# Altium schematic sheet io.SchDoc
size A
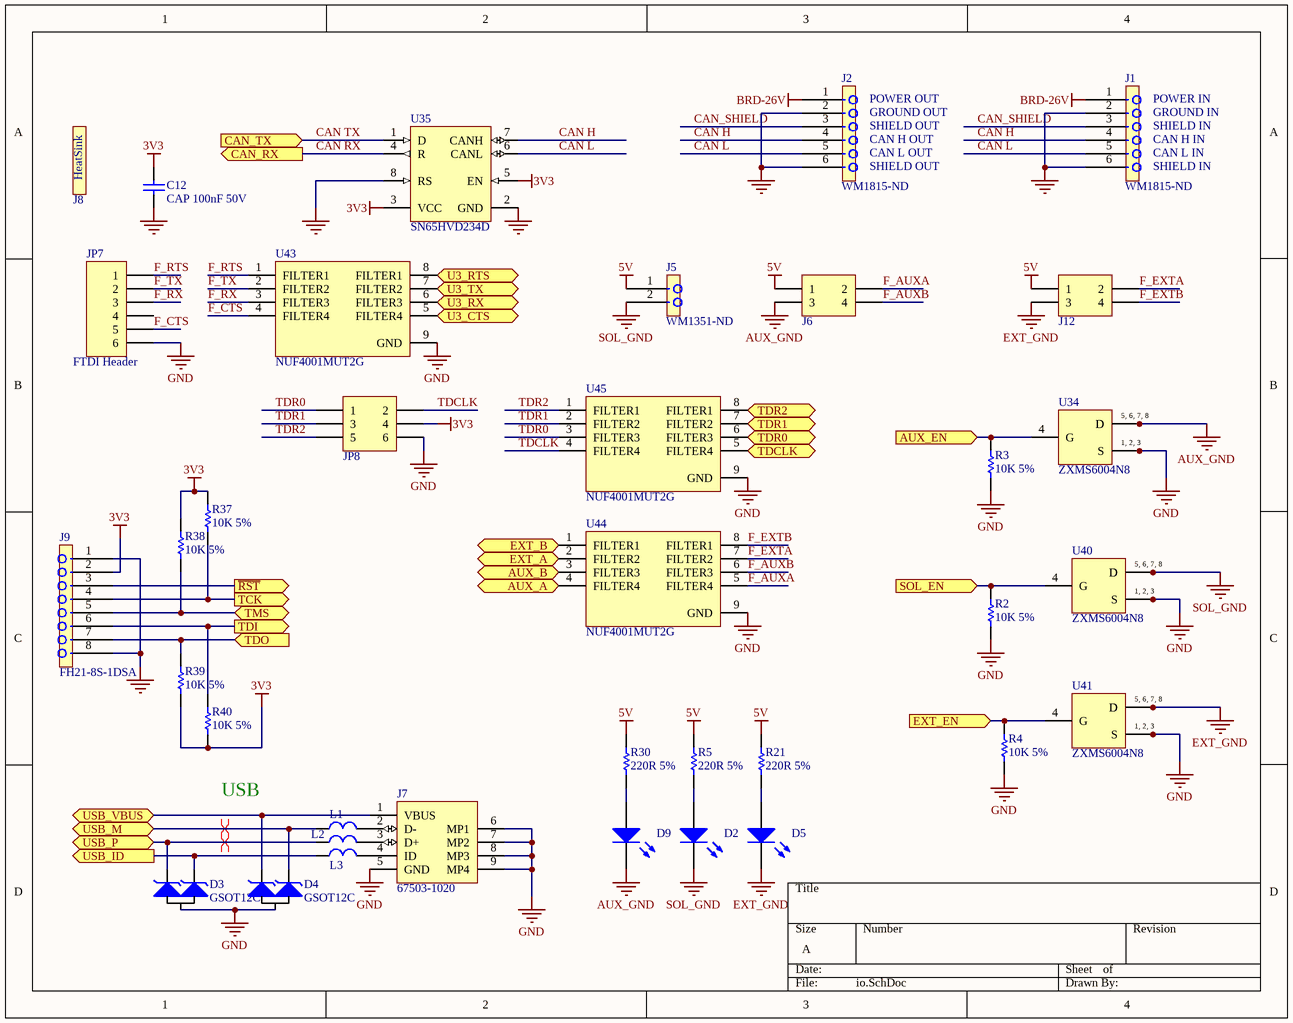
[diagram p0: io.SchDoc]

## Parts
C12  CAP 100nF 50V  [CAPC0603(1608)100_M]
D2  LED  [LED-0603]  (value not drawn)
D3  GSOT12C  [SOT-23 - ESD]
D4  GSOT12C  [SOT-23 - ESD]
D5  LED  [LED-0603]  (value not drawn)
D9  LED  [LED-0603]  (value not drawn)
J1  WM1815-ND  [M43045H-6]
J2  WM1815-ND  [M43045H-6]
J5  WM1351-ND  [M5569-2]
J6  Header 2x2 2.54mm  [Molex 39-30-1040]  (value not drawn)
J7  67503-1020  [MOLX-67503-1020_V]
J8  HeatSink  [HeatSink]  (value not drawn)
J9  FH21-8S-1DSA  [FH21-8S-1DSA]
J12  Header 2x2 2.54mm  [Molex 39-30-1040]  (value not drawn)
JP7  FTDI Header  [1X6]
JP8  Header 3x2 2.54mm  [2X3]  (value not drawn)
L1  MPZ1608S102A  [0603]  (value not drawn)
L2  MPZ1608S102A  [0603]  (value not drawn)
L3  MPZ1608S102A  [0603]  (value not drawn)
R2  10K 5%  [RESC0603(1608)_N]
R3  10K 5%  [RESC0603(1608)_N]
R4  10K 5%  [RESC0603(1608)_N]
R5  220R 5%  [RESC0603(1608)_M]
R21  220R 5%  [RESC0603(1608)_M]
R30  220R 5%  [RESC0603(1608)_M]
R37  10K 5%  [RESC0603(1608)_N]
R38  10K 5%  [RESC0603(1608)_N]
R39  10K 5%  [RESC0603(1608)_N]
R40  10K 5%  [RESC0603(1608)_N]
U34  ZXMS6004N8  [SO-8]
U35  SN65HVD234D  [D8_M]
U40  ZXMS6004N8  [SO-8]
U41  ZXMS6004N8  [SO-8]
U43  NUF4001MUT2G  [ONSC-UDFN-8-517AD_V]
U44  NUF4001MUT2G  [ONSC-UDFN-8-517AD_V]
U45  NUF4001MUT2G  [ONSC-UDFN-8-517AD_V]

## Ports
AUX_A (bidir), AUX_B (bidir), AUX_EN (in), CAN_RX (out), CAN_TX (in), EXT_A (bidir), EXT_B (bidir), EXT_EN (in), SOL_EN (in), TCK (out), TDCLK (bidir), TDI (out), TDO (in), TDR0 (bidir), TDR1 (bidir), TDR2 (bidir), TMS (bidir), U3_CTS (in), U3_RTS (out), U3_RX (out), U3_TX (in), USB_ID (out), USB_M (bidir), USB_P (bidir), USB_VBUS, ~{RST} (out)

## Nets
3V3: C12.2 J9.2 JP8.4 R37.2 R38.2 R39.1 R40.1 U35.3(VCC) U35.5(EN)
5V: J5.1 J6.1 J12.1 R5.2 R21.2 R30.2
AUX_GND: D9.2(K) J6.3 U34.5(D) U34.6(D) U34.7(D) U34.8(D)
BRD-26V: J1.1 J2.1
EXT_GND: D5.2(K) J12.3 U41.5(D) U41.6(D) U41.7(D) U41.8(D)
GND: C12.1 D3.3(A) D4.3(A) J1.2 J1.6 J2.2 J2.6 J7.5(GND) J7.6(MP1) J7.7(MP2) J7.8(MP3) J7.9(MP4) J9.1 J9.8 JP7.6 JP8.6 R2.1 R3.1 R4.1 U34.1(S) U34.2(S) U34.3(S) U35.2(GND) U35.8(RS) U40.1(S) U40.2(S) U40.3(S) U41.1(S) U41.2(S) U41.3(S) U43.9(GND) U44.9(GND) U45.9(GND)
SOL_GND: D2.2(K) J5.2 U40.5(D) U40.6(D) U40.7(D) U40.8(D)
AUX_A: U44.4(FILTER4) ; port AUX_A
AUX_B: U44.3(FILTER3) ; port AUX_B
AUX_EN: R3.2 U34.4(G) ; port AUX_EN
CAN H: J1.4 J2.4 U35.7(CANH)
CAN L: J1.5 J2.5 U35.6(CANL)
CAN RX: U35.4(R) ; port CAN_RX
CAN TX: U35.1(D) ; port CAN_TX
CAN_SHIELD: J1.3 J2.3
EXT_A: U44.2(FILTER2) ; port EXT_A
EXT_B: U44.1(FILTER1) ; port EXT_B
EXT_EN: R4.2 U41.4(G) ; port EXT_EN
F_AUXA: J6.2 U44.5(FILTER4)
F_AUXB: J6.4 U44.6(FILTER3)
F_CTS: JP7.5 U43.4(FILTER4)
F_EXTA: J12.2 U44.7(FILTER2)
F_EXTB: J12.4 U44.8(FILTER1)
F_RTS: JP7.1 U43.1(FILTER1)
F_RX: JP7.3 U43.3(FILTER3)
F_TX: JP7.2 U43.2(FILTER2)
~{RST}: J9.3 ; port ~{RST}
SOL_EN: R2.2 U40.4(G) ; port SOL_EN
TCK: J9.4 R37.1 ; port TCK
TDCLK: JP8.2 U45.4(FILTER4)
TDCLK: U45.5(FILTER4) ; port TDCLK  [a separate net that carries the same name]
TDI: J9.6 R40.2 ; port TDI
TDO: J9.7 R39.2 ; port TDO
TDR0: JP8.1 U45.3(FILTER3)
TDR0: U45.6(FILTER3) ; port TDR0  [a separate net that carries the same name]
TDR1: JP8.3 U45.2(FILTER2)
TDR1: U45.7(FILTER2) ; port TDR1  [a separate net that carries the same name]
TDR2: JP8.5 U45.1(FILTER1)
TDR2: U45.8(FILTER1) ; port TDR2  [a separate net that carries the same name]
TMS: J9.5 R38.1 ; port TMS
U3_CTS: U43.5(FILTER4) ; port U3_CTS
U3_RTS: U43.8(FILTER1) ; port U3_RTS
U3_RX: U43.6(FILTER3) ; port U3_RX
U3_TX: U43.7(FILTER2) ; port U3_TX
USB_ID: D3.2(K2) L3.1 ; port USB_ID
USB_M: D4.2(K2) L1.1 ; port USB_M
USB_P: D3.1(K1) L2.1 ; port USB_P
USB_VBUS: D4.1(K1) J7.1(VBUS) ; port USB_VBUS
NetD2_1: D2.1(A) R5.1
NetD5_1: D5.1(A) R21.1
NetD9_1: D9.1(A) R30.1
NetJ7_2: J7.2(D-) L1.2
NetJ7_3: J7.3(D+) L2.2
NetJ7_4: J7.4(ID) L3.2

Not connected (* = marked no-connect by the designer): JP7 4

## Layout directives
differential pair: USB_M, USB_P

## Notes on the sheet
- (near J2) POWER OUT
- (near J1) POWER IN
- (near J2) GROUND OUT
- (near J2) SHIELD OUT
- (near J2) CAN H OUT
- (near J2) CAN L OUT
- (near J1) GROUND IN
- (near J1) SHIELD IN
- (near J1) CAN H IN
- (near J1) CAN L IN
- (near R40) USB
- (in symbol ZXMS6004N8) 5, 6, 7, 8; 1, 2, 3

## Library data of the parts
C12 = CMP-1035-00010-1: CAP 100nF 50V Â±0.1pF 0603 (1608 Metric) Thickness 1mm SMD; Case-Metric: 1608; Case-EIA: 0603; Tolerance: Â±0.1pF; Technology: SMT; Value: 100nF; Max Thickness: 1 mm; Rated Voltage: 50 V
D2 D5 D9 = LED: Typical RED, GREEN, YELLOW, AMBER GaAs LED; Published: 8-Jun-2000; LatestRevisionDate: 17-Jul-2002; LatestRevisionNote: Re-released for DXP Platform.; PackageVersion: Feb-2002; PackageReference: 3.2X1.6X1.1; Publisher: Altium Limited; PackageDescription: SM LED; 2 Flat Leads; Supplier 1: Digi-Key; Supplier Part Number 1: 475-1409-1-ND; Supplier 2: Digikey; Supplier Part Number 2: SML-D12M1WT86TR-ND
D3 D4 = 2749: DIO GSOT12C ESD 2LINE 12V SOT23; MPN: GSOT12C-E3-08; COST1K: 0.11250; COST10: 0.3750; COST100: 0.25000; MAN: Vishay Semiconductor Diodes Division; SPN: GSOT12C-E3-08DKR-ND; Supplier: Digi-Key
J1 J2 = CON6: CID: 317; Supplier 1: Digikey; Supplier Part Number 1: WM1815-ND
J5 = CON2: 6.35mm right-angle 90° male spade terminal PCB mount; Supplier 1: Digikey; Supplier Part Number 1: WM1351-ND
J6 J12 = Header 2x2: Header, 4-Pin; Supplier 1: Digikey; Supplier Part Number 1: WM1352-ND
J7 = CMP-0411-00002-1: USB, MINI, SMD, RA KME04-USBMU03A01; Manufacturer: Molex; ComponentLink1URL: http://www.molex.com/; PartNumber: 67503-1020; Mounting Technology: Surface Mount; ComponentLink1Description: Manufacturer URL; Terminal Pitch: 0.8 mm; DatasheetVersion: Rev F, 06/2009; ComponentLink2Description: Datasheet; PackageDescription: Mini USB Connector, SMT, Righer Angle; ComponentLink2URL: http://www.molex.com/pdm_docs/sd/675031020_sd.pdf; PackageReference: 67503-1020
J9 = CON8
JP7 = Header 6: Header, 6-Pin; Supplier 1: Digi-Key; Supplier 2: Mouser; Supplier Part Number 1: 952-2270-ND; Supplier Part Number 2: 538-90120-1086
JP8 = Header 3x2: Header, 6-Pin; Supplier 1: Digi-Key; Supplier 2: Mouser; Supplier Part Number 1: 952-1788-ND; Supplier Part Number 2: 855-M20-9980446
L1-L3 = 2982: IND FERRITE CHIP BEAD 1000 OHM @ 100MHz 800mA 0603; COST1K: 0.02717; COST10: 0.0790; COST100: 0.04720; MAN: TDK Corporation; SPN: 445-8694-6-ND; MPN: MPZ1608S102A; Supplier: Digi-Key
R2-R4 R37-R40 = CMP-1012-00098-1: 10K 0.1W 5% 0603 (1608 Metric)  SMD; Case-EIA: 0603; Value: 10000.00 Ohm; Case-Metric: 1608; Technology: SMT; Tolerance: 5 %; Power: 0.1 W
R5 R21 R30 = CMP-1012-00058-1: 220R 0.1W 5% 0603 (1608 Metric)  SMD; Case-EIA: 0603; Case-Metric: 1608; Value: 220.00 Ohm; Technology: SMT; Power: 0.1 W; Tolerance: 5 %
U34 U40 U41 = ZXMS6004N8: MOSFET N-CH 60V 1.3A S08; Manufacturer: On Semiconductor; PartNumber: NCV8402ASTT1G; Packing: Tape and Reel; Channel Polarity: N Channel; ComponentLink3Description: Package Specification; ComponentLink3URL: http://www.onsemi.com/pub_link/Collateral/318E-04.PDF; ComponentLink1URL: http://www.onsemi.com/; PackageDescription: 4-Pin Small Outline Transistor, Body 6.5 x 3.5 mm, Pitch 2.3 mm; DatasheetVersion: Rev. 8; ComponentLink1Description: Manufacturer URL; Mounting Technology: Surface Mount; PackageVersion: Rev. N, 08/2009; PackageReference: SOT-223-4-318E-04; ComponentLink2URL: http://www.onsemi.com/pub_link/Collateral/NCV8402-D.PDF; ComponentLink2Description: Datasheet; RoHS: Pb-Free; Supplier 1: Digikey; Supplier Part Number 1: ZXMS6004N8-13DICT-ND
U35 = CMP-0315-00083-1: 3.3V CAN Transceiver with Sleep Mode, 6 mA, -40 to 125 degC, 8-pin SOIC (D), Green (RoHS & no Sb/Br); Manufacturer: Texas Instruments; Receivers Per Package: 1; ICC(Max)(mA): 6; Bus Fault Voltage(V): +/-30; Supply Voltage(s)(V): 3.3; Rating: Catalog; Transient Pulse Protection(V): -100 to 100; PartNumber: SN65HVD234D; SubFamily: CAN; DatasheetVersion: SLLS557F; Mounting Technology: Surface Mount; Eco-Plan: Green (RoHS & no Sb/Br); PackageVersion: revM, Jun-2011; PackageReference: D8; ComponentLink1Description: Datasheet; Drivers Per Package: 1; Isolated: No; ComponentLink1URL: http://www.ti.com/general/docs/lit/getliterature.tsp?genericPartNumber=SN65HVD234&fileType=pdf; PackageDescription: 8-Pin Plastic Small Outline Integrated Circuit, 4.9 x 3.9 mm, Pitch 1.27 mm Pitch; Code_JEDEC: MS-012AA; Low Power Mode: Sleep; Footprint: PCA82C250, excludes pin5
U43-U45 = CMP-1066-00052-1: 4-Channel EMI Filter with Integrated ESD Protection, -40 to 85 degC, 8-Pin UDFN, Pb-Free, Tape and Reel; Manufacturer: On Semiconductor; VRWM Max (V): 5; V(BR) Typ (V): 7; Number of Lines: 4; ComponentLink2Description: Datasheet; ComponentLink1URL: http://www.onsemi.com/; DatasheetVersion: Rev. 7; PackageVersion: Rev. D, 10/2012; Mounting Technology: Surface Mount; ComponentLink3Description: Package Specification; PartNumber: NUF4001MUT2G; ComponentLink2URL: http://www.onsemi.cn/pub_link/Collateral/NUF4001MU-D.PDF; Packing: Tape and Reel; PackageReference: UDFN-8-517AD; ComponentLink1Description: Manufacturer URL; RoHS: Pb-Free; ComponentLink3URL: http://www.onsemi.com/pub_link/Collateral/517AD.PDF; PackageDescription: 8-Pin Small Outline No-Lead, Body 1.8 x 1.2 mm, Pitch 0.4 mm